# Altium project PCB_Project1.PrjPCB
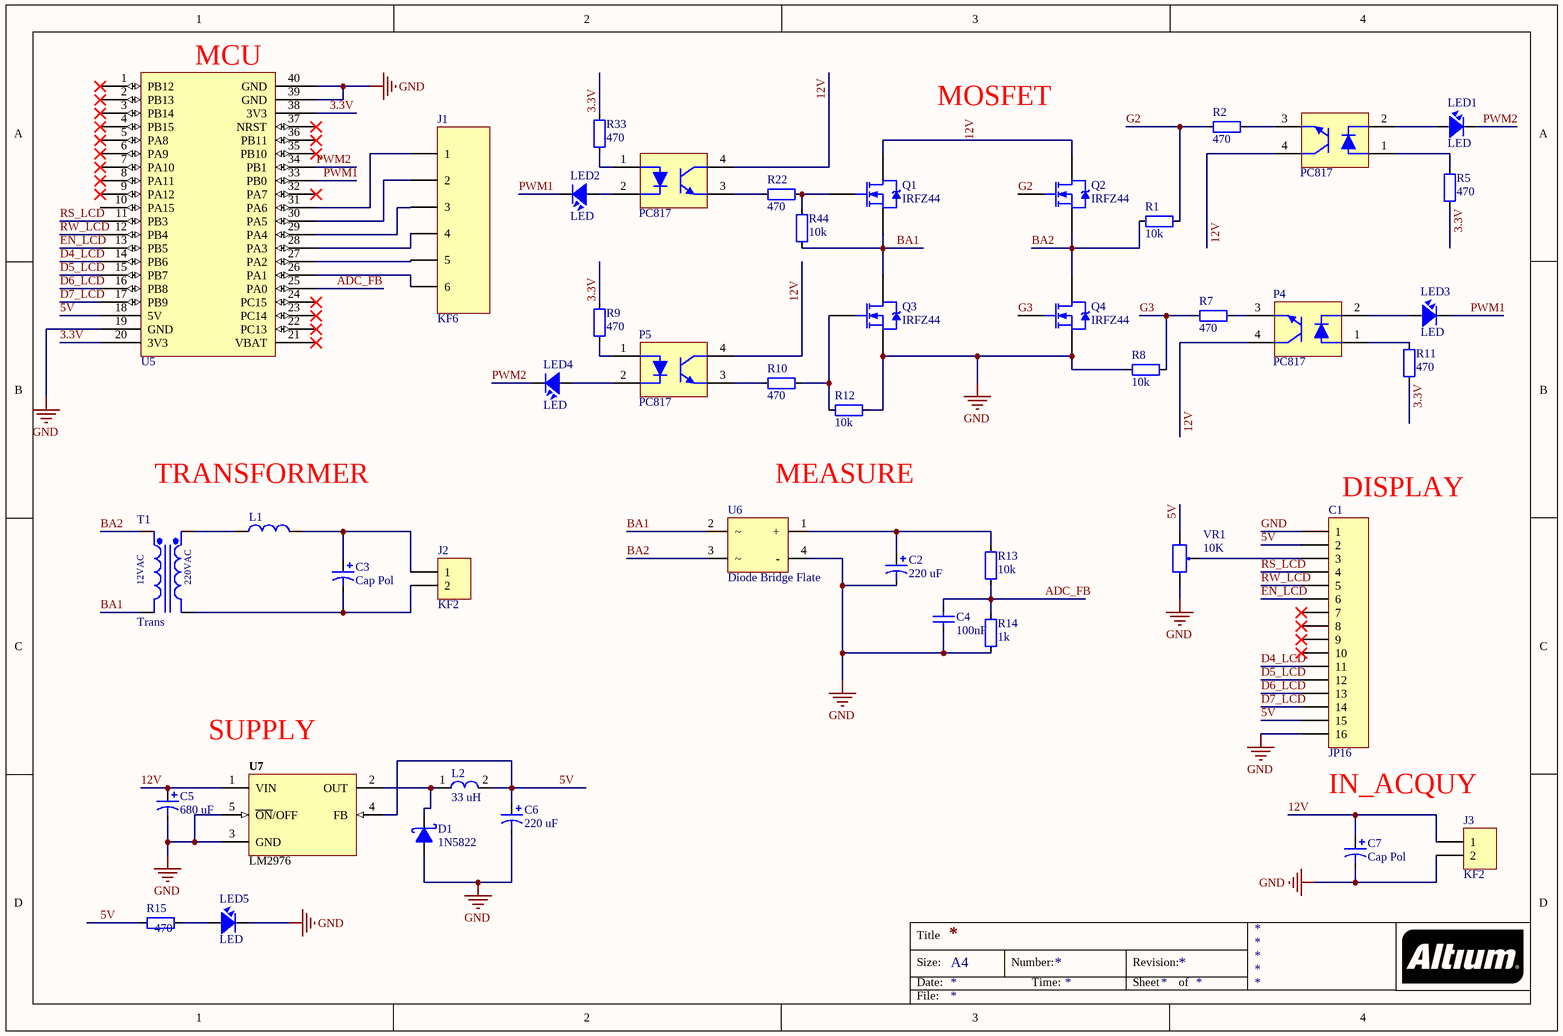
[diagram p0: Sheet1.SchDoc]
1 sheet, 46 parts. Net scope: global (net labels, ports and power ports of the same name join across sheets).
Board file: PCB1.PcbDoc

## Sheet Sheet1.SchDoc
size A4

### Parts
C1  JP16  [JP16-C1T]
C2  220 uF  [C8mm]
C3  Cap Pol  [C12mm]
C4  100nF  [CAP_0805]
C5  680 uF  [C12mm]
C6  220 uF  [C8mm]
C7  Cap Pol  [C12mm]
D1  1N5822  [DIO-SMD-123]
J1  KF6  [KF6-5]
J2  KF2  [KF2-5.08]
J3  KF2  [KF2-5.08]
L1  150mH  [L01]  (value not drawn)
L2  33 uH  [L-SMD-M-7.3x4.5]
LED1  LED  [LED-1206-Red]
LED2  LED  [LED-1206-Red]
LED3  LED  [LED-1206-Red]
LED4  LED  [LED-1206-Red]
LED5  LED  [LED-1206-Red]
P1  PC817  [DIP-4]
P3  PC817  [DIP-4]
P4  PC817  [DIP-4]
P5  PC817  [DIP-4]
Q1  IRFZ44  [TO-220-Heatsink]
Q2  IRFZ44  [TO-220-Heatsink]
Q3  IRFZ44  [TO-220-Heatsink]
Q4  IRFZ44  [TO-220-Heatsink]
R1  10k  [RES-SMD-0805]
R2  470  [RES-SMD-0805]
R5  470  [RES-SMD-0805]
R7  470  [RES-SMD-0805]
R8  10k  [RES-SMD-0805]
R9  470  [RES-SMD-0805]
R10  470  [RES-SMD-0805]
R11  470  [RES-SMD-0805]
R12  10k  [RES-SMD-0805]
R13  10k  [RES-SMD-0805]
R14  1k  [RES-SMD-0805]
R15  470  [RES-SMD-0805]
R22  470  [RES-SMD-0805]
R33  470  [RES-SMD-0805]
R44  10k  [RES-SMD-0805]
T1  Trans  [Transformer 12V-6VA]
U5  STM32 BluePill  [STM32 Bluepill]  (value not drawn)
U6  Diode Bridge Flate  [DB207S]
U7  LM2976  [TO-263]
VR1  10K  [VR]

### Nets
GND: C1.1 C1.16 C2.2 C4.1 C5.2 C6.2 C7.2 D1.1(A) J3.2 LED5.2 Q3.3(S) Q4.3(S) R8.2 R12.1 R14.2 U5.19(GND) U5.39(GND) U5.40(GND) U6.4(-) U7.3(GND) U7.5(~{ON}/OFF) VR1.3
3.3V: R5.2 R9.2 R11.2 R33.2 U5.20(3V3) U5.38(3V3)
5V: C1.2 C1.15 C6.1 L2.2 R15.1 U5.18(5V) U7.4(FB) VR1.1
12V: C5.1 C7.1 J3.1 P1.4 P3.4 P4.4 P5.4 Q1.2(D) Q2.2(D) U7.1(VIN)
ADC_FB: C4.2 R13.2 R14.1 U5.25(PA0)
BA1: Q1.3(S) Q3.2(D) R44.1 T1.2(Pri-) U6.2
BA2: Q2.3(S) Q4.2(D) R1.1 T1.1(Pri+) U6.3
D4_LCD: C1.11 U5.14(PB6)
D5_LCD: C1.12 U5.15(PB7)
D6_LCD: C1.13 U5.16(PB8)
D7_LCD: C1.14 U5.17(PB9)
EN_LCD: C1.6 U5.13(PB5)
G2: Q2.1(G) R1.2 R2.1
G3: Q4.1(G) R7.2 R8.1
PWM1: LED2.2 LED3.2 U5.33(PB0)
PWM2: LED1.2 LED4.2 U5.34(PB1)
RS_LCD: C1.4 U5.11(PB3)
RW_LCD: C1.5 U5.12(PB4)
NetC1_3: C1.3 VR1.2
NetC2_1: C2.1 R13.1 U6.1(+)
NetC3_1: C3.1 J2.1 L1.2
NetC3_2: C3.2 J2.2 T1.4(Sec-)
NetD1_2: D1.2(K) L2.1 U7.2(OUT)
NetJ1_1: J1.1 U5.31(PA6)
NetJ1_2: J1.2 U5.30(PA5)
NetJ1_3: J1.3 U5.29(PA4)
NetJ1_4: J1.4 U5.28(PA3)
NetJ1_5: J1.5 U5.27(PA2)
NetJ1_6: J1.6 U5.26(PA1)
NetL1_1: L1.1 T1.3(Sec+)
NetLED1_1: LED1.1 P1.2
NetLED2_1: LED2.1 P3.2
NetLED3_1: LED3.1 P4.2
NetLED4_1: LED4.1 P5.2
NetLED5_1: LED5.1 R15.2
NetP1_1: P1.1 R5.1
NetP1_3: P1.3 R2.2
NetP3_1: P3.1 R33.1
NetP3_3: P3.3 R22.1
NetP4_1: P4.1 R11.1
NetP4_3: P4.3 R7.1
NetP5_1: P5.1 R9.1
NetP5_3: P5.3 R10.2
NetQ1_1: Q1.1(G) R22.2 R44.2
NetQ3_1: Q3.1(G) R10.1 R12.2

Not connected (* = marked no-connect by the designer): C1 7* 8* 9* 10*; U5 1(PB12)* 2(PB13)* 3(PB14)* 4(PB15)* 5(PA8)* 6(PA9)* 7(PA10)* 8(PA11)* 9(PA12)* 10(PA15) 21(VBAT)* 22(PC13)* 23(PC14)* 24(PC15)* 32(PA7)* 35(PB10)* 36(PB11)* 37(NRST)*

### Notes on the sheet
- (near U5) MCU
- MOSFET
- TRANSFORMER
- MEASURE
- (near C1) DISPLAY
- (near U7) SUPPLY
- IN_ACQUY
- Title
- Size:
- Date:
- A4
- Number:
- Time:
- Revision:
- Sheet
- of
- File:
- (in symbol Trans) 12VAC; 220VAC

### Library data of the parts
C1 = JP16: WR-PHD 2.54 mm Angled Socket Header; Manufacturer: W¨¹rth Elektronik eiSos GmbH; partNo: 613016143121; ComponentLink1 Description: Manufacturer; ComponentLink2 Description: Datasheet; NoPins: 16; Created Date: 29 March 2013; ComponentLink1URL: http://www.we-online.com; ComponentLink2URL: http://katalog.we-online.de/em/datasheet/6130xx143121.pdf; Created by: Karrer Zheng
C2 C3 C5-C7 = Cap Pol: Polarized Capacitor (Axial); Published: 8-Jun-2000; LatestRevisionDate: 17-Jul-2002; LatestRevisionNote: Re-released for DXP Platform.; PackageReference: POLAR0.8; Publisher: Altium Limited
C4 = CapSMD: Capacitor; Value: 33p; Published: 8-Jun-2000; LatestRevisionDate: 17-Jul-2002; LatestRevisionNote: Re-released for DXP Platform.; PackageReference: RAD-0.3; Publisher: Altium Limited
D1 = 1N5822: Schottky Rectifiers; Value: Diode c?m 1N5408
J1 = KF6: Manufacturer: W¨¹rth Elektronik eiSos GmbH; PartNo: 691133710006; ComponentLink1 Description: Manufacturer; ComponentLink2 Description: Datasheet; NoPins: 6; ComponentLink1 URL: http://www.we-online.com; ComponentLink2 URL: http://katalog.we-online.de/em/datasheet/6911337100xx.pdf; Created By: Baojun Chen; Created Date: 4-Aug-15
J2 J3 = KF2: Manufacturer: Würth Elektronik eiSos GmbH; partNo: 691103110002; ComponentLink1 Description: Manufacturer; ComponentLink2 Description: Datasheet; NoPins: 2; Created Date: 29 October 2013; ComponentLink1URL: http://www.we-online.com; ComponentLink2URL: http://katalog.we-online.de/em/datasheet/6911031100xx.pdf; Created by: Karrer Zheng
L1 = L1: Inductor; Value: 150 mH
L2 = L-SMD-1: partNo: 78477010; Manufacturer: Wurth Elektronik; Inductance: 1.0 μH; ComponentLink1Description: Manufacturer; ComponentLink1URL: http://www.we-online.de; Created by: Baojun Chen; Created Date: Nov.2015; ComponentLink2Description: Datasheet; ComponentLink2URL: http://katalog.we-online.de/pbs/datasheet/78477010.pdf
LED1-LED5 = LED: LED Single colour Green and Red; Value: LED 3 ly Single Colour
P1 P3-P5 = PC817: NPN PHOTO General Purpose Amplifier; Published: 8-Jun-2000; LatestRevisionDate: 15-Jan-2003; LatestRevisionNote: PCB Footprint 'BCY-W3/D4.7' replaced; DatasheetDocument: 1997; PackageReference: TO-92A; Publisher: Altium Limited; Code_JEDEC: TO-92A
Q1-Q4 = IRFZ44: Value: IRF840
R1 R2 R5 R7-R15 R22 R33 R44 = Resistor - SMD: Resistor; Manufacturer: Generic Components; Class: Passive; Published: 08/06/2000; Publisher: Altium Hobart Technology Centre
T1 = Trans: Transformer (12V-6VA); Published: 8-Jun-2000; LatestRevisionDate: 17-Jul-2002; LatestRevisionNote: Re-released for DXP Platform.; PackageReference: TRF_4; Publisher: Altium Limited; PackageDescription: Transformer; 4 Leads
U5 = STM32 BluePill: STM32F103C8T6 breakout board
U6 = Diode Bridge Flate: Diode Bridge
U7 = LM2596: Max Input Voltage: 12 V; Max Output Current: 3 (6.0 peak) A; Max Output Voltage: mV; Category: IC-Power; Min Input Voltage: mV; Min Output Voltage: mV; Mounting Technology: Surface Mount; Status: Unreleased; Supply Voltage: mV; Temperature Range: -40 to +125 degC
VR1 = VR: Var Resistor; Value: VR 10K